# Altium schematic sheet RP_ComputeModule3_rev.3.0_Headers.SchDoc
size A4 portrait
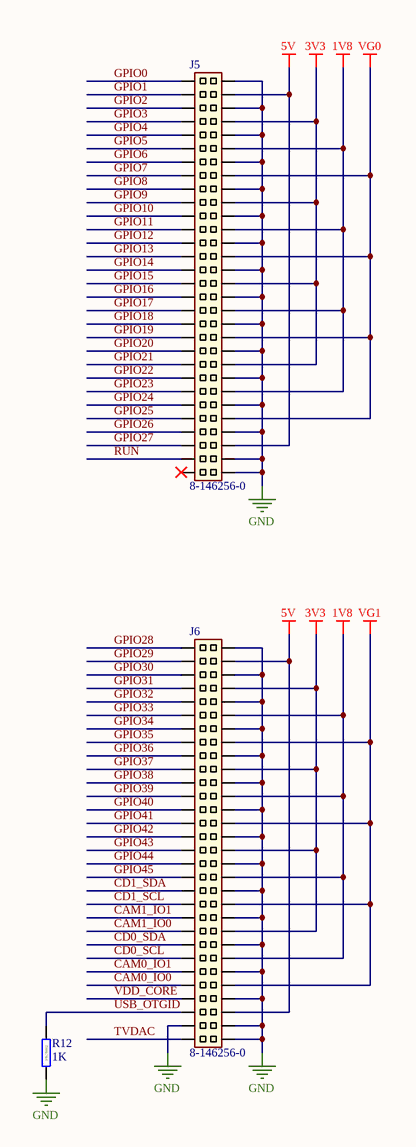
[diagram p0: RP_ComputeModule3_rev.3.0_Headers.SchDoc]

## Parts
J5  8-146256-0  [TE 2x30 PINS 8-146256-0]
J6  8-146256-0  [TE 2x30 PINS 8-146256-0]
R12  1K  [RES0402]

## Nets
1V8: J5.12 J5.24 J5.36 J5.48 J6.12 J6.24 J6.36 J6.48
3V3: J5.8 J5.20 J5.32 J5.44 J6.8 J6.20 J6.32 J6.44
5V: J5.4 J5.56 J6.4 J6.56
GND: J5.2 J5.6 J5.10 J5.14 J5.18 J5.22 J5.26 J5.30 J5.34 J5.38 J5.42 J5.46 J5.50 J5.54 J5.58 J5.60 J6.2 J6.6 J6.10 J6.14 J6.18 J6.22 J6.26 J6.30 J6.34 J6.38 J6.42 J6.46 J6.50 J6.54 J6.57 J6.58 J6.60 R12.2
VG0: J5.16 J5.28 J5.40 J5.52
VG1: J6.16 J6.28 J6.40 J6.52
CAM0_IO0: J6.51
CAM0_IO1: J6.49
CAM1_IO0: J6.43
CAM1_IO1: J6.41
CD0_SCL: J6.47
CD0_SDA: J6.45
CD1_SCL: J6.39
CD1_SDA: J6.37
GPIO0: J5.1
GPIO1: J5.3
GPIO2: J5.5
GPIO3: J5.7
GPIO4: J5.9
GPIO5: J5.11
GPIO6: J5.13
GPIO7: J5.15
GPIO8: J5.17
GPIO9: J5.19
GPIO10: J5.21
GPIO11: J5.23
GPIO12: J5.25
GPIO13: J5.27
GPIO14: J5.29
GPIO15: J5.31
GPIO16: J5.33
GPIO17: J5.35
GPIO18: J5.37
GPIO19: J5.39
GPIO20: J5.41
GPIO21: J5.43
GPIO22: J5.45
GPIO23: J5.47
GPIO24: J5.49
GPIO25: J5.51
GPIO26: J5.53
GPIO27: J5.55
GPIO28: J6.1
GPIO29: J6.3
GPIO30: J6.5
GPIO31: J6.7
GPIO32: J6.9
GPIO33: J6.11
GPIO34: J6.13
GPIO35: J6.15
GPIO36: J6.17
GPIO37: J6.19
GPIO38: J6.21
GPIO39: J6.23
GPIO40: J6.25
GPIO41: J6.27
GPIO42: J6.29
GPIO43: J6.31
GPIO44: J6.33
GPIO45: J6.35
RUN: J5.57
TVDAC: J6.59
USB_OTGID: J6.55 R12.1
VDD_CORE: J6.53

Not connected (* = marked no-connect by the designer): J5 59*

## Notes on the sheet
- (in symbol RK73H1FTTBL1001F) 1% | 0402

## Library data of the parts
J5 J6 = 8-146256-0: Headers & Wire Housings 60 MODII HDR DRST B/A .100CL LF; Manufacturer: TE Connectivity; Number of Positions: 60; Insulation Resistance: 5GR; Connector Type: Plug,Pin,Header; Board Standoff: Yes (With); Contact Protection: No (Without); High Speed Serial Data Connector: No; High Temperature Housing: Yes; PCB Mount Retention: Without; PCB Mounting Orientation: Vertical; Contact Current Rating: 3A; Pitch: 2.54mm; Mating Post Length: 0.23inch; PCB Thickness: 0.062inch; Approvals: CSA; Supplier 1: Mouser; Manufacturer Part Number: 8-146256-0; Stock 1: 114; Pricing 1: 1=7.66, 10=7.66, 50=6.28, 100=5.82, 1000=4.97, 10000=4.97 (USD); Mount: Through Hole; Contact Material: Bronze; Contact Plating: Nickel,Tin,Gold,Matte; Colour: Black; Housing Colour: Black; Housing Material: Thermoplastic; Contact Shape: Square; Min Operating Temperature: -65°C; Max Operating Temperature: 105°C; Contact Gender: Male; Package Quantity: 50; Number of Rows: 2; Packaging: Carton; Termination: Through Hole; Number of Contacts: 60; Orientation: Straight; Gasket: No (Without); Keyed: No; Mating Alignment: No (Without); Mating Connector Lock: No (Without); Selectively Loaded: No (Without); Stabilizers: No (Without); Strain Relief: No (Without); Length: 75.79mm; Row Spacing: 2.54mm; Termination Post Length: 0.12inch; Contact Mating Length: 0.23inch; Depth: 4.88mm; Radiation Hardening: No; ELV: Compliant; Flammability Rating: UL94 V-0; ComponentLink1URL: https://datasheet.ciiva.com/734/eng-cd-146256-g-146256-c-dwg-734694.pdf; ComponentLink1Description: https://datasheet.ciiva.com/734/eng-cd-146256-g-146256-c-dwg-734694.pdf; ComponentLink2URL: https://datasheet.ciiva.com/9491/eng-ds-1307819-ampmodu-0811-9491229.pdf; ComponentLink2Description: https://datasheet.ciiva.com/9491/eng-ds-1307819-ampmodu-0811-9491229.pdf
R12 = RK73H1FTTBL1001F: Thick Film Resistors - SMD 1/3W 1K OHM 1%; Manufacturer: KOA Speer; Power Rating: 30 mW; Resistance: 1 kOhms; Temperature Coefficient: 250 PPM / C; Voltage Rating: 15 V; Qualification: AEC-Q200; Supplier 1: Mouser; Manufacturer Part Number: RK73H1FTTBL1001F; RoHS: RoHS Compliant By Exemption; Category: Thick Film Resistors - SMD; Stock 1: 6349; Pricing 1: 1=0.641, 10=0.346, 100=0.196, 1000=0.130, 20000=0.123, 40000=0.101 (USD); Height: 0.13 mm; Length: 0.4 mm; Operating Temperature Range: - 55 C to + 125 C; Package / Case: 01005 (0402 metric); Packaging: Cut Tape; Product: Thick Film Resistors SMD; Series: RK73H; Termination Style: SMD/SMT; Tolerance: 1 %; Type: Precision Resistor; Width: 0.2 mm; Brand: KOA Speer; Case Code - in: 01005; Case Code - mm: 0402; Maximum Operating Temperature: + 125 C; Minimum Operating Temperature: - 55 C; Standard Pack Qty: 20000; RoHS - Mouser: E; Minimum Order Quantity: 1; Reeling: True; ComponentLink1URL: http://www.mouser.com/ds/2/219/RK73H-5715.pdf; ComponentLink1Description: http://www.mouser.com/ds/2/219/RK73H-5715.pdf